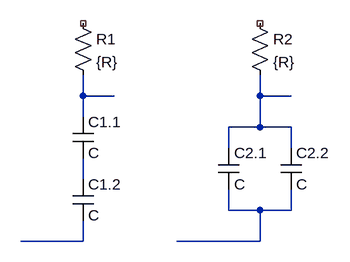
[diagram p0: schematic Draft4.asc]
Draft4.asc, the LTspice schematic file:
Version 4
SHEET 1 880 680
WIRE 112 32 112 0
WIRE 160 32 112 32
WIRE 384 32 384 0
WIRE 432 32 384 32
WIRE 112 64 112 32
WIRE 384 80 384 32
WIRE 384 80 336 80
WIRE 432 80 384 80
WIRE 336 112 336 80
WIRE 432 112 432 80
WIRE 112 160 112 128
WIRE 336 208 336 176
WIRE 384 208 336 208
WIRE 432 208 432 176
WIRE 432 208 384 208
WIRE 112 256 112 224
WIRE 112 256 16 256
WIRE 384 256 384 208
WIRE 384 256 256 256
SYMBOL cap 96 64 R0
SYMATTR InstName C1.1
SYMBOL cap 96 160 R0
SYMATTR InstName C1.2
SYMBOL cap 320 112 R0
SYMATTR InstName C2.1
SYMBOL cap 416 112 R0
SYMATTR InstName C2.2
SYMBOL res 96 -96 R0
SYMATTR InstName R1
SYMATTR Value {R}
SYMBOL res 368 -96 R0
SYMATTR InstName R2
SYMATTR Value {R}

The netlist it stands for:
* Draft4.asc
C1.1 N001 N003 C
C1.2 N003 N005 C
C2.1 N002 N004 C
C2.2 N002 N004 C
R1 NC_01 N001 {R}
R2 NC_02 N002 {R}
.backanno
.end